# EAGLE design m5-3 (EAGLE 5.11)
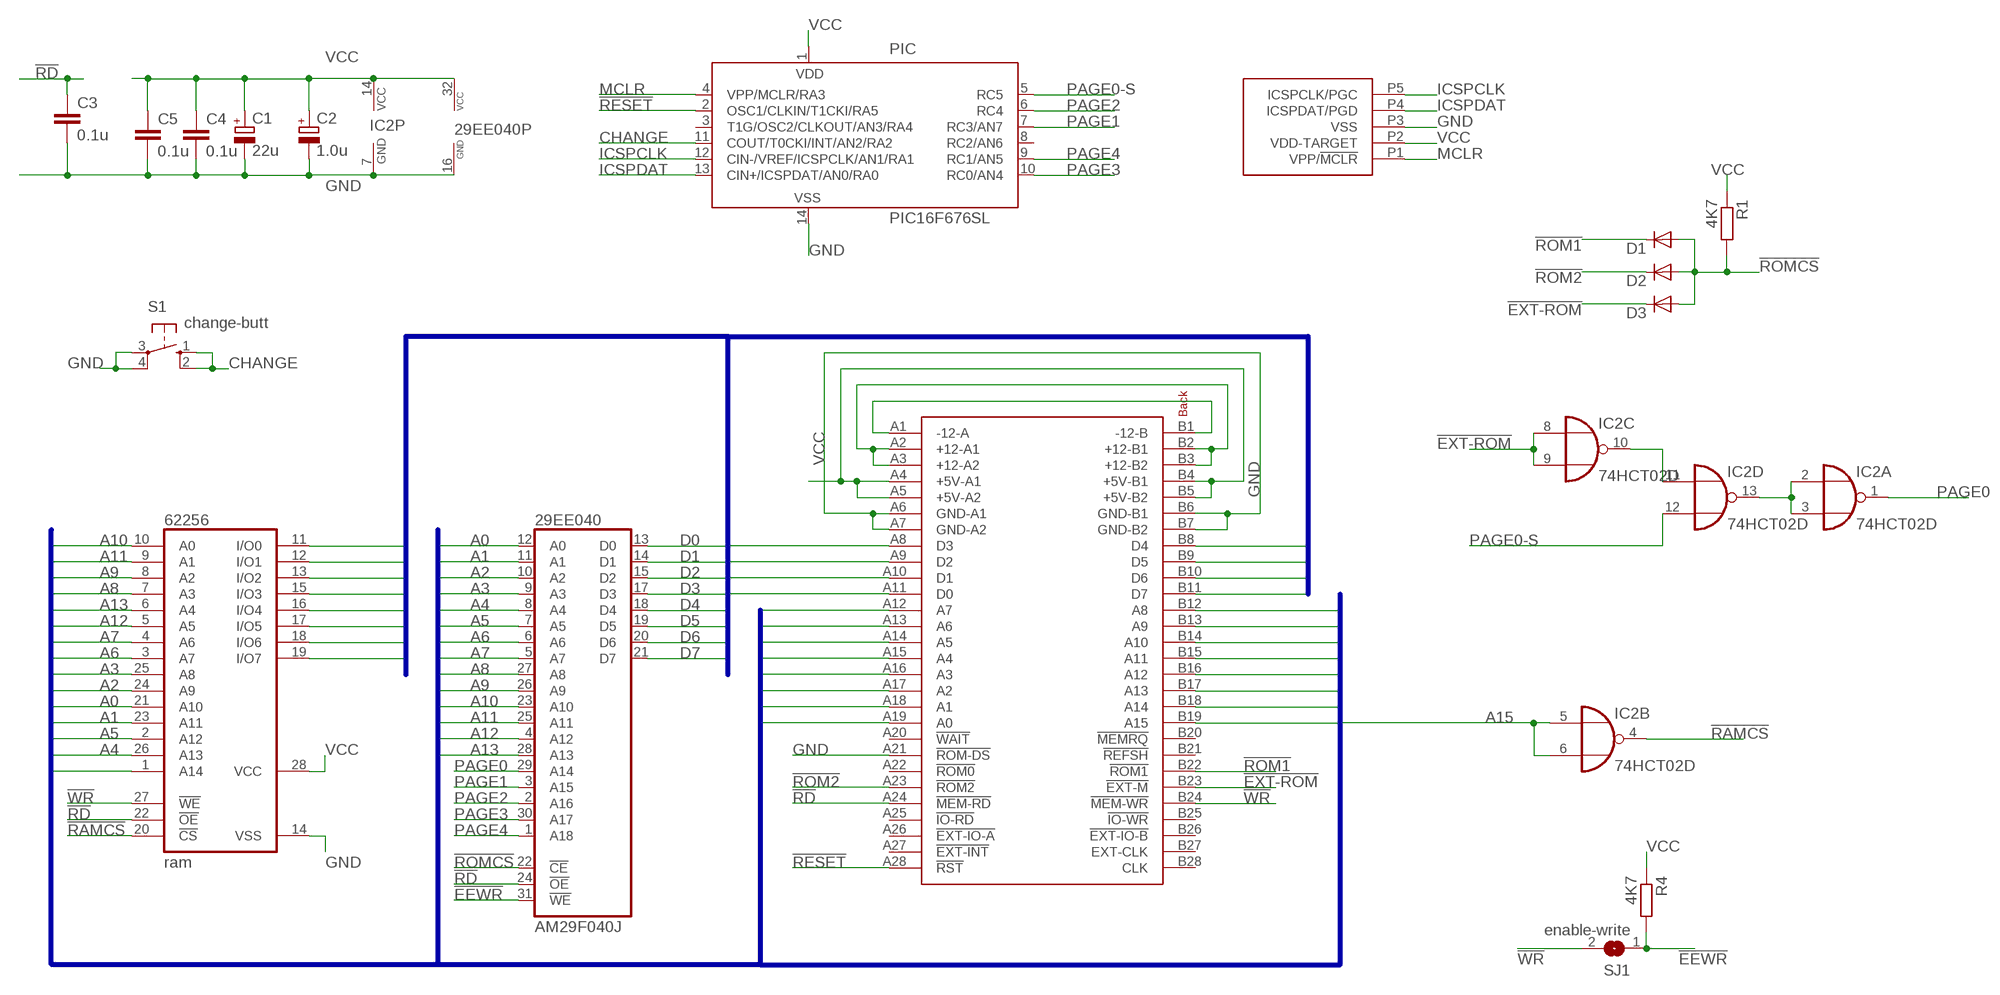
[diagram p0: schematic, sheet 1]

## Parts
29EE040  AM29F040J  [PLCC32R]
62256  ram  62256FP  [SO28L]
C1  22u  CPOL-EUC  [PANASONIC_C]
C2  1.0u  CPOL-EUC  [PANASONIC_C]
C3  0.1u  C-EUC1206  [C1206]
C4  0.1u  C-EUC1206  [C1206]
C5  0.1u  C-EUC1206  [C1206]
D1  DIODE-SOD123  [SOD123]
D2  DIODE-SOD123  [SOD123]
D3  DIODE-SOD123  [SOD123]
IC2  74HCT02D  [SO14]
PIC  PIC16F676SL  [SO-14]
R1  4K7  R-EU_R1206  [R1206]
R4  4K7  R-EU_R1206  [R1206]
S1  change-butt  40/XX  [B3F/40XX]
SJ1  enable-write  SJ  [SJ]
U$1  SORD-M5-EDGE  [SORD-M5-EDGE]
U$2  PICKIT2-ICSP-5  [PICKIT2-ICSP-5]

## Nets
!EEWR: 29EE040.31(!WE) R4.2 SJ1.1
!EXT-ROM: D3.C IC2.8(C:I0) IC2.9(C:I1) U$1.B23(!EXT-M)
!RAMCS: 62256.20(!CS) IC2.4(B:O)
!RD: 29EE040.24(!OE) 62256.22(!OE) C3.1 U$1.A24(!MEM-RD)
!RESET: PIC.2(OSC1/CLKIN/T1CKI/RA5) U$1.A28(!RST)
!ROM1: D1.C U$1.B22(!ROM1)
!ROM2: D2.C U$1.A23(!ROM2)
!ROMCS: 29EE040.22(!CE) D1.A D2.A D3.A R1.2
!WR: 62256.27(!WE) SJ1.2 U$1.B24(!MEM-WR)
A0: 29EE040.12(A0) 62256.21(A10) U$1.A19(A0)
A1: 29EE040.11(A1) 62256.23(A11) U$1.A18(A1)
A2: 29EE040.10(A2) 62256.24(A9) U$1.A17(A2)
A3: 29EE040.9(A3) 62256.25(A8) U$1.A16(A3)
A4: 29EE040.8(A4) 62256.26(A13) U$1.A15(A4)
A5: 29EE040.7(A5) 62256.2(A12) U$1.A14(A5)
A6: 29EE040.6(A6) 62256.3(A7) U$1.A13(A6)
A7: 29EE040.5(A7) 62256.4(A6) U$1.A12(A7)
A8: 29EE040.27(A8) 62256.7(A3) U$1.B12(A8)
A9: 29EE040.26(A9) 62256.8(A2) U$1.B13(A9)
A10: 29EE040.23(A10) 62256.10(A0) U$1.B14(A10)
A11: 29EE040.25(A11) 62256.9(A1) U$1.B15(A11)
A12: 29EE040.4(A12) 62256.5(A5) U$1.B16(A12)
A13: 29EE040.28(A13) 62256.6(A4) U$1.B17(A13)
A14: 62256.1(A14) U$1.B18(A14)
A15: IC2.5(B:I0) IC2.6(B:I1) U$1.B19(A15)
CHANGE: PIC.11(COUT/T0CKI/INT/AN2/RA2) S1.1(S) S1.2(S1)
D0: 29EE040.13(D0) 62256.19(I/O7) U$1.A11(D0)
D1: 29EE040.14(D1) 62256.18(I/O6) U$1.A10(D1)
D2: 29EE040.15(D2) 62256.17(I/O5) U$1.A9(D2)
D3: 29EE040.17(D3) 62256.16(I/O4) U$1.A8(D3)
D4: 29EE040.18(D4) 62256.15(I/O3) U$1.B8(D4)
D5: 29EE040.19(D5) 62256.11(I/O0) U$1.B9(D5)
D6: 29EE040.20(D6) 62256.12(I/O1) U$1.B10(D6)
D7: 29EE040.21(D7) 62256.13(I/O2) U$1.B11(D7)
GND: 29EE040.16(GND) 62256.14(VSS) C1.- C2.- C3.2 C4.2 C5.2 IC2.7(P:GND) PIC.14(VSS) S1.3(P) S1.4(P1) U$1.A6(GND-A1) U$1.A7(GND-A2) U$1.A21(!ROM-DS) U$1.B6(GND-B1) U$1.B7(GND-B2) U$2.P3(VSS)
ICSPCLK: PIC.12(CIN-/VREF/ICSPCLK/AN1/RA1) U$2.P5(ICSPCLK/PGC)
ICSPDAT: PIC.13(CIN+/ICSPDAT/AN0/RA0) U$2.P4(ICSPDAT/PGD)
MCLR: PIC.4(VPP/MCLR/RA3) U$2.P1(VPP/!MCLR)
N$2: U$1.A1(-12-A) U$1.B1(-12-B)
N$3: IC2.10(C:O) IC2.11(D:I0)
N$5: U$1.A2(+12-A1) U$1.A3(+12-A2) U$1.B2(+12-B1) U$1.B3(+12-B2)
N$6: IC2.2(A:I0) IC2.3(A:I1) IC2.13(D:O)
PAGE0: 29EE040.29(A14) IC2.1(A:O)
PAGE0-S: IC2.12(D:I1) PIC.5(RC5)
PAGE1: 29EE040.3(A15) PIC.7(RC3/AN7)
PAGE2: 29EE040.2(A16) PIC.6(RC4)
PAGE3: 29EE040.30(A17) PIC.10(RC0/AN4)
PAGE4: 29EE040.1(A18) PIC.9(RC1/AN5)
VCC: 29EE040.32(VCC) 62256.28(VCC) C1.+ C2.+ C4.1 C5.1 IC2.14(P:VCC) PIC.1(VDD) R1.1 R4.1 U$1.A4(+5V-A1) U$1.A5(+5V-A2) U$1.B4(+5V-B1) U$1.B5(+5V-B2) U$2.P2(VDD-TARGET)
Unconnected: PIC.3(T1G/OSC2/CLKOUT/AN3/RA4) PIC.8(RC2/AN6) U$1.A20(!WAIT) U$1.A22(!ROM0) U$1.A25(!IO-RD) U$1.A26(!EXT-IO-A) U$1.A27(!EXT-INT) U$1.B20(!MEMRQ) U$1.B21(!REFSH) U$1.B25(!IO-WR) U$1.B26(!EXT-IO-B) U$1.B27(EXT-CLK) U$1.B28(CLK)

## Buses
D[0..7]
A[0..15]

## Library data of the parts
29EE040 = am29-memory:AM29F040J: 4-Megabit FLASH MEMORY (512 K x 8 bit) 5 V-only
62256 = memory-hitachi:62256FP: MEMORY
C1 C2 = resistor:CPOL-EU: POLARIZED CAPACITOR, European symbol
C3-C5 = resistor:C-EU: CAPACITOR, European symbol
D1-D3 = diode:DIODE-: DIODE
IC2 = 74xx-eu:74*02: Quad 2-input NOR gate
PIC = microchip:PIC16F676: 14-Pin, Flash-Based 8-Bit CMOS Microcontroller High Performance RISC CPU: * Only 35 instructions to learn - All single-cycle instructions except branches * Operating speed: - DC - 20 MHz oscillator/clock input - DC - 200 ns instruction cycle * Internal and external oscillator options - Precision Internal 4 MHz oscillator factory calibrated to ±1% - External Oscillator support for crystals and resonators - 5?s wake-up from SLEEP, 3.0V, typical * Power saving SLEEP mode * Wide operating voltage range - 2.0V to 5.5V * Industrial and Extended temperature range * Low power Power-on Reset (POR) * Power-up Timer (PWRT) and Oscillator Start-up Timer (OST) * Brown-out Detect (BOD) * Watchdog Timer (WDT) with independent oscillator for reliable operation * Multiplexed MCLR/Input-pin * Interrupt-on-pin change * Individual programmable weak pull-ups * Programmable code protection * High Endurance FLASH/EEPROM Cell - 100,000 write FLASH endurance - 1,000,000 write EEPROM endurance - FLASH/Data EEPROM Retention: > 40 years * Standby Current: - 1 nA @ 2.0V, typical * Operating Current: - 8.5?A @ 32 kHz, 2.0V, typical - 100?A @ 1 MHz, 2.0V, typical * Watchdog Timer Current - 300 nA @ 2.0V, typical * Timer1 oscillator current: - 4?A @ 32 kHz, 2.0V, typical * 12 I/O pins with individual direction control * High current sink/source for direct LED drive * Analog-to-Digital Converter module (PIC16F676): - 10-bit resolution - Programmable 8-channel input - Voltage reference input * In-Circuit Serial ProgrammingTM (ICSPTM) via two pins Source: http://ww1.microchip.com/downloads/en/DeviceDoc/40039E.pdf
R1 R4 = rcl:R-EU_: RESISTOR, European symbol
S1 = switch-omron:40/XX: OMRON SWITCH
SJ1 = jumper:SJ: SMD solder JUMPER
U$1 = SordM5:SORD-M5-EDGE: Sord M5 Cartridge Connector
U$2 = pickit2:PICKIT2-ICSP-5: PICKit2 ICSP header - 5 pin version

## Board
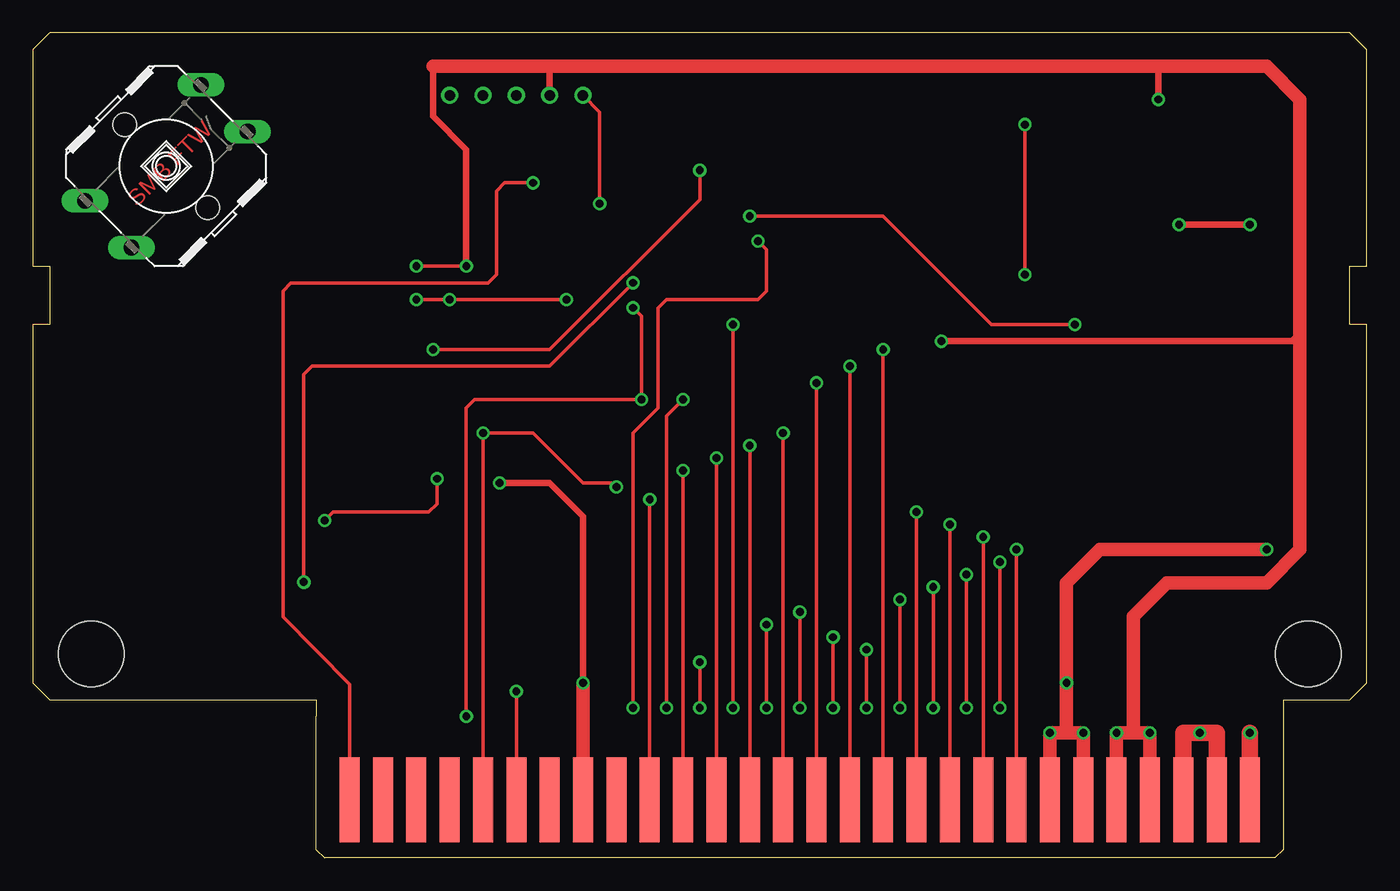
[diagram p1: board, top side]
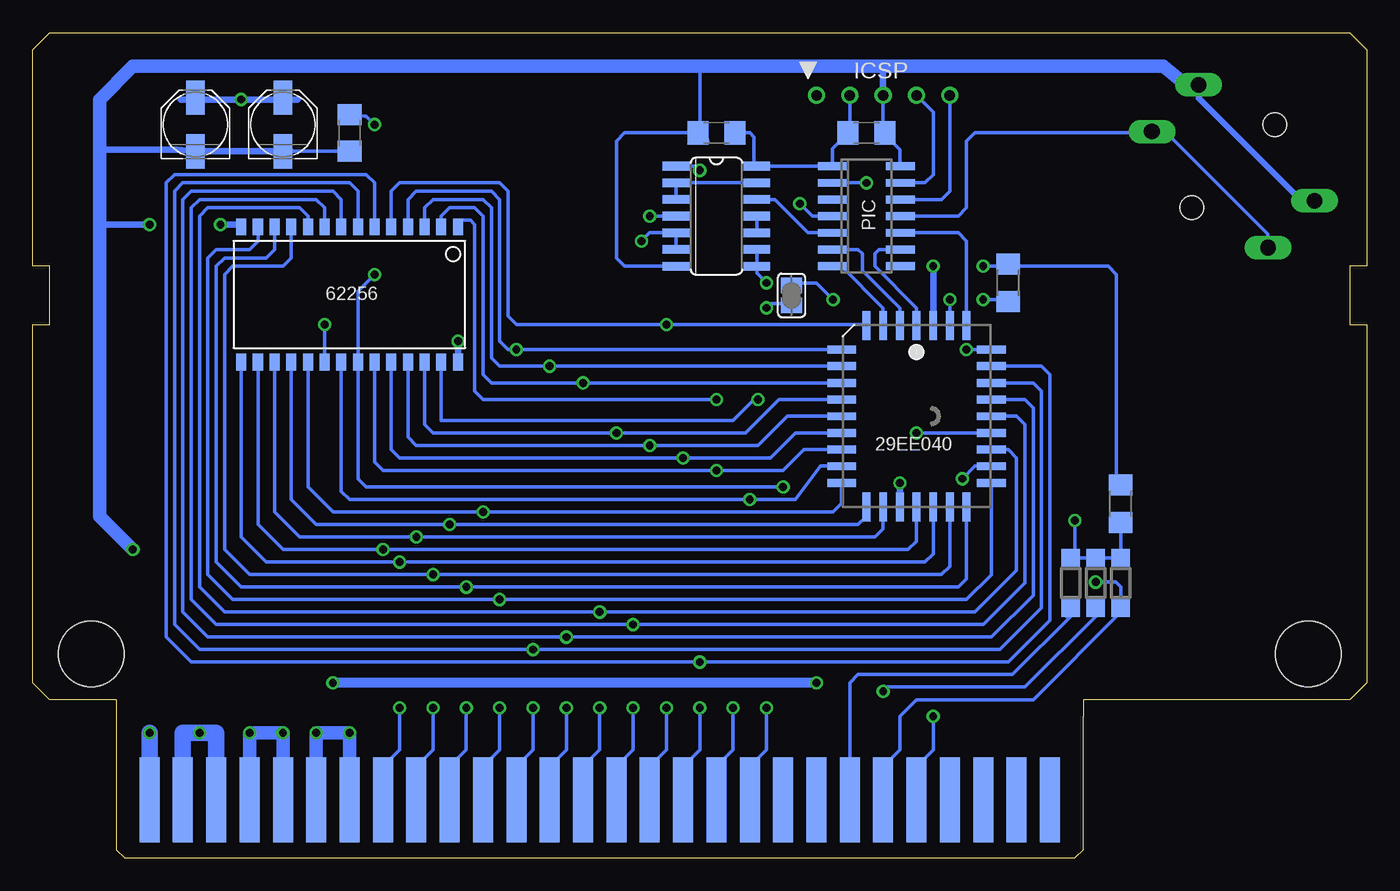
[diagram p2: board, bottom side, seen from below]

Size 101.6 x 62.87 mm. Coordinates in mm from the lower left corner, seen from the top.
Outline: 21.59,10.8 21.59,12.07 1.27,12.07 0,13.34 0,40.64 1.27,40.64 1.27,45.09 0,45.09 0,61.59 1.27,62.87 100.33,62.87 101.6,61.59 101.6,45.09 100.33,45.09 100.33,40.64 101.6,40.64 101.6,13.34 100.33,12.07 95.25,12.07 95.25,10.8
Copper layers (1*16): Top 0.035mm / dielectric 1.5mm / Bottom 0.035mm
Design rules "default": minimum track width 10mil, minimum drill 24mil, track to track 8mil, track to pad 8mil, pad to pad 8mil, via to via 8mil, smd to smd 8mil, copper to edge 40mil, drill to drill 8mil, minimum pad ring 10mil, minimum via ring 8mil, stop-mask expansion 4mil, vias tented up to drill 0mil, thermal gap 10mil
Holes 5 mm at 97.16,15.56 4.45,15.56

### Footprints (pad centres in the part's own frame; a part is rotated, then mirrored left to right if it is on the bottom)
PLCC32R = smd 0.6 x 2.2: 1 0,6.9; 2 -1.27,6.9; 3 -2.54,6.9; 4 -3.81,6.9; 14 -3.81,-6.9; 15 -2.54,-6.9; 16 -1.27,-6.9; 17 0,-6.9; 18 1.27,-6.9; 19 2.54,-6.9; 20 3.81,-6.9; 30 3.81,6.9; 31 2.54,6.9; 32 1.27,6.9 | smd 2.2 x 0.6: 5 -5.7,5.08; 6 -5.7,3.81; 7 -5.7,2.54; 8 -5.7,1.27; 9 -5.7,0; 10 -5.7,-1.27; 11 -5.7,-2.54; 12 -5.7,-3.81; 13 -5.7,-5.08; 21 5.7,-5.08; 22 5.7,-3.81; 23 5.7,-2.54; 24 5.7,-1.27; 25 5.7,0; 26 5.7,1.27; 27 5.7,2.54; 28 5.7,3.81; 29 5.7,5.08
SO28L = smd 0.762 x 1.27: 1 -7.62,-5.207; 2 -6.35,-5.207; 3 -5.08,-5.207; 4 -3.81,-5.207; 5 -2.54,-5.207; 6 -1.27,-5.207; 7 0,-5.207; 8 1.27,-5.207; 9 2.54,-5.207; 10 3.81,-5.207; 11 5.08,-5.207; 12 6.35,-5.207; 13 7.62,-5.207; 14 8.89,-5.207; 15 8.89,5.08; 16 7.62,5.08; 17 6.35,5.08; 18 5.08,5.08; 19 3.81,5.08; 20 2.54,5.08; 21 1.27,5.08; 22 0,5.08; 23 -1.27,5.08; 24 -2.54,5.08; 25 -3.81,5.08; 26 -5.08,5.08; 27 -6.35,5.08; 28 -7.62,5.08
PANASONIC_C = smd 2.6 x 1.4: + 2.05,0; - -2.05,0
C1206 = smd 1.6 x 1.8: 1 -1.4,0; 2 1.4,0
SOD123 = smd 1.4 x 1.4: A 1.9,0; C -1.9,0
SO14 = smd 0.66 x 2.032: 1 -3.81,-3.073; 2 -2.54,-3.073; 3 -1.27,-3.073; 4 0,-3.073; 5 1.27,-3.073; 6 2.54,-3.073; 7 3.81,-3.073; 8 3.81,3.073; 9 2.54,3.073; 10 1.27,3.073; 11 0,3.073; 12 -1.27,3.073; 13 -2.54,3.073; 14 -3.81,3.073
SO-14 = smd 0.6 x 2.2: 1 -3.81,-2.6; 2 -2.54,-2.6; 3 -1.27,-2.6; 4 0,-2.6; 5 1.27,-2.6; 6 2.54,-2.6; 7 3.81,-2.6; 8 3.81,2.6; 9 2.54,2.6; 10 1.27,2.6; 11 0,2.6; 12 -1.27,2.6; 13 -2.54,2.6; 14 -3.81,2.6
R1206 = smd 1.6 x 1.803: 1 -1.422,0; 2 1.422,0
B3F/40XX = drill 1.194 long: 1 -6.198,-2.642; 2 2.642,6.198; 3 -2.642,-6.198; 4 6.198,2.642 | hole 1.803: -3.175,3.175; 3.175,-3.175
SJ = smd 1.168 x 1.6: 1 -0.762,0; 2 0.762,0
SORD-M5-EDGE = smd 1.524 x 6.477: A1 34.29,0; A2 31.75,0; A3 29.21,0; A4 26.67,0; A5 24.13,0; A6 21.59,0; A7 19.05,0; A8 16.51,0; A9 13.97,0; A10 11.43,0; A11 8.89,0; A12 6.35,0; A13 3.81,0; A14 1.27,0; A15 -1.27,0; A16 -3.81,0; A17 -6.35,0; A18 -8.89,0; A19 -11.43,0; A20 -13.97,0; A21 -16.51,0; A22 -19.05,0; A23 -21.59,0; A24 -24.13,0; A25 -26.67,0; A26 -29.21,0; A27 -31.75,0; A28 -34.29,0 | smd 1.524 x 6.477 bottom: B1 34.29,0; B2 31.75,0; B3 29.21,0; B4 26.67,0; B5 24.13,0; B6 21.59,0; B7 19.05,0; B8 16.51,0; B9 13.97,0; B10 11.43,0; B11 8.89,0; B12 6.35,0; B13 3.81,0; B14 1.27,0; B15 -1.27,0; B16 -3.81,0; B17 -6.35,0; B18 -8.89,0; B19 -11.43,0; B20 -13.97,0; B21 -16.51,0; B22 -19.05,0; B23 -21.59,0; B24 -24.13,0; B25 -26.67,0; B26 -29.21,0; B27 -31.75,0; B28 -34.29,0
PICKIT2-ICSP-5 = drill 0.8 round: P1 0,5.08; P2 0,2.54; P3 0,0; P4 0,-2.54; P5 0,-5.08

### Placement (x,y rotation side)
29EE040  34.29,33.66 0 bottom
62256  76.83,42.86 180 bottom
C1  82.55,55.88 90 bottom
C2  89.22,55.88 90 bottom
C3  77.47,55.25 270 bottom
C4  38.1,55.25 0 bottom
C5  49.53,55.25 180 bottom
D1  22.54,20.96 90 bottom
D2  20.64,20.96 90 bottom
D3  18.73,20.96 90 bottom
IC2  49.53,48.9 270 bottom
PIC  38.1,48.9 270 bottom
R1  18.73,26.99 270 bottom
R4  27.3,43.81 270 bottom
S1  10.16,52.7 180 top
SJ1  43.81,42.86 270 bottom
U$1  58.42,4.45 0 top
U$2  36.83,58.1 90 bottom

### Tracks (layer width: path | path; a pad name or v marks a point on that pad's centre or on a via)
!EEWR  (via drill 0.6)
  Top 0.254: v40.64,42.55 v31.75,42.55 v29.21,42.55
  Bottom 0.254: SJ1.1 43.62,43.81 41.91,43.81 v40.64,42.55 | v31.75,42.55 29EE040.31 | v29.21,42.55 27.94,42.55 27.79,42.39 R4.2
!EXT-ROM  (via drill 0.6, 0.61)
  Top 0.254: v45.72,43.81 39.37,37.47 21.27,37.47 20.64,36.83 v20.64,21.02
  Bottom 0.254: U$1.B23 36.83,6.98 35.56,8.26 35.56,10.8 34.29,12.07 25.41,12.07 18.73,18.73 D3.C | IC2.9 IC2.8 46.46,44.55 v45.72,43.81 | v20.64,21.02 19.11,21.02 18.73,20.64 D3.C | D3.C 18.8,19.18
!RAMCS  (via drill 0.6)
  Top 0.254: v79.38,40.64 73.03,40.64 64.77,48.9 v54.61,48.9
  Bottom 0.254: v79.38,40.64 62256.20 | IC2.4 v54.61,48.9
!RD  (via drill 0.6)
  Top 0.254: U$1.A24 v34.29,32.39 38.1,32.39 41.91,28.58 44.13,28.58 v44.45,28.26 | v75.56,44.45 v75.56,55.88
  Bottom 0.254: v75.56,44.45 76.83,43.18 62256.22 76.83,28.89 76.2,28.26 v44.45,28.26 | 29EE040.24 v34.29,32.39 | 76.33,56.52 C3.1 76.2,56.52 v75.56,55.88
!RESET  (via drill 0.6)
  Top 0.254: v38.1,51.44 35.94,51.44 35.31,50.8 35.31,44.45 34.67,43.81 19.62,43.81 19.05,43.18 19.05,18.35 24.13,13.21 U$1.A28
  Bottom 0.254: v38.1,51.44 PIC.2
!ROM1
  Bottom 0.254: U$1.B22 39.37,13.34 38.73,13.97 26.99,13.97 22.54,18.41 22.86,18.41 D1.C
!ROM2  (via drill 0.6)
  Top 0.254: v36.83,12.7 U$1.A23
  Bottom 0.254: v36.83,12.7 36.51,13.02 26.04,13.02 20.64,18.41 D2.C
!ROMCS  (via drill 0.6)
  Top 0.254: v30.8,28.89 30.8,26.99 30.16,26.35 22.86,26.35 v22.23,25.72
  Bottom 0.254: 29EE040.22 29.84,29.84 v30.8,28.89 | v22.23,25.72 22.23,23.18 D1.A D2.A D3.A R1.2
!WR  (via drill 0.6)
  Top 0.254: v33.02,10.8 33.02,34.29 33.66,34.92 v46.35,34.92 46.35,41.28 v45.72,41.91
  Bottom 0.254: U$1.B24 34.29,6.98 33.02,8.26 v33.02,10.8 | 62256.27 70.48,33.34 48.26,33.34 46.67,34.92 v46.35,34.92 | v45.72,41.91 45.4,42.23 44.13,42.23 SJ1.2
A0  (via drill 0.6)
  Top 0.254: v46.99,27.3 U$1.A19
  Bottom 0.254: 29EE040.12 41.59,29.84 43.5,27.3 v46.99,27.3 77.47,27.3 78.11,27.94 62256.21
A1  (via drill 0.6)
  Top 0.254: v49.53,29.53 U$1.A18
  Bottom 0.254: 29EE040.11 42.86,31.12 44.45,29.53 v49.53,29.53 74.93,29.53 75.56,30.16 62256.23
A2  (via drill 0.6)
  Top 0.254: v52.07,30.48 U$1.A17
  Bottom 0.254: 29EE040.10 43.5,32.39 45.4,30.48 v52.07,30.48 73.66,30.48 74.3,31.12 62256.24
A3  (via drill 0.6)
  Top 0.254: U$1.A16 v54.61,31.43
  Bottom 0.254: 29EE040.9 44.13,33.66 46.35,31.43 v54.61,31.43 72.39,31.43 73.03,32.07 62256.25
A4  (via drill 0.6)
  Top 0.254: U$1.A15 v57.15,32.39
  Bottom 0.254: 29EE040.8 44.77,34.92 47.31,32.39 v57.15,32.39 71.12,32.39 71.75,33.02 62256.26
A5  (via drill 0.6)
  Top 0.254: U$1.A14 v59.69,36.2
  Bottom 0.254: 29EE040.7 v59.69,36.2 66.67,36.2 67.31,36.83 67.31,48.9 67.94,49.53 69.85,49.53 70.48,48.9 62256.2
A6  (via drill 0.6)
  Top 0.254: U$1.A13 v62.23,37.47
  Bottom 0.254: 29EE040.6 v62.23,37.47 66.04,37.47 66.67,38.1 66.67,49.53 67.31,50.17 71.12,50.17 71.75,49.53 62256.3
A7  (via drill 0.6)
  Top 0.254: U$1.A12 v64.77,38.73
  Bottom 0.254: 29EE040.5 v64.77,38.73 65.41,38.73 66.04,39.37 66.04,50.17 66.67,50.8 72.39,50.8 73.03,50.17 62256.4
A8  (via drill 0.6)
  Top 0.254: v63.5,15.88 v63.5,11.43
  Bottom 0.254: 62256.7 76.83,50.8 77.47,51.44 90.17,51.44 90.81,50.8 90.81,17.78 88.9,15.88 v63.5,15.88 27.94,15.88 24.77,19.05 24.77,35.56 25.4,36.2 29EE040.27 | v63.5,11.43 63.5,8.26 64.77,6.98 U$1.B12
A9  (via drill 0.6)
  Top 0.254: v60.96,16.83 v60.96,11.43
  Bottom 0.254: 29EE040.26 26.04,34.92 25.4,34.29 25.4,20 28.57,16.83 v60.96,16.83 88.27,16.83 90.17,18.73 90.17,50.17 89.53,50.8 78.74,50.8 78.11,50.17 62256.8 | v60.96,11.43 60.96,8.26 62.23,6.98 U$1.B13
A10  (via drill 0.6)
  Top 0.254: v58.42,11.43 v58.42,18.73
  Bottom 0.254: 29EE040.23 27.3,31.12 26.67,30.48 26.67,21.91 29.84,18.73 v58.42,18.73 87,18.73 88.9,20.64 88.9,48.9 88.27,49.53 81.28,49.53 80.64,48.9 62256.10 | v58.42,11.43 58.42,8.26 59.69,6.98 U$1.B14
A11  (via drill 0.6)
  Top 0.254: v55.88,17.78 v55.88,11.43
  Bottom 0.254: 29EE040.25 26.67,33.66 26.04,33.02 26.04,20.96 29.21,17.78 v55.88,17.78 87.63,17.78 89.53,19.69 89.53,49.53 88.9,50.17 80.01,50.17 79.38,49.53 62256.9 | v55.88,11.43 55.88,8.26 57.15,6.98 U$1.B15
A12  (via drill 0.6)
  Top 0.254: v53.34,11.43 v53.34,40.64
  Bottom 0.254: 38.19,40.87 29EE040.4 38.19,40.64 v53.34,40.64 64.77,40.64 65.41,41.28 65.41,50.8 66.04,51.44 73.66,51.44 74.3,50.8 62256.5 | v53.34,11.43 53.34,8.26 54.61,6.98 U$1.B16
A13  (via drill 0.6)
  Top 0.254: v50.8,11.43 v50.8,14.92
  Bottom 0.254: 29EE040.28 24.77,37.47 24.13,36.83 24.13,18.1 27.3,14.92 v50.8,14.92 89.53,14.92 91.44,16.83 91.44,51.44 90.81,52.07 76.2,52.07 75.56,51.44 62256.6 | v50.8,11.43 50.8,8.26 52.07,6.98 U$1.B17
A14  (via drill 0.6)
  Top 0.254: v48.26,11.43 48.26,33.66 v49.53,34.92
  Bottom 0.254: v49.53,34.92 67.31,34.92 67.94,35.56 67.94,48.26 68.26,48.58 69.03,48.58 62256.1 | v48.26,11.43 48.26,8.26 49.53,6.98 U$1.B18
A15  (via drill 0.6)
  Top 0.254: v45.72,11.43 45.72,32.39 47.62,34.29 47.62,41.91 48.26,42.55 55.24,42.55 55.88,43.18 55.88,46.36 v55.24,46.99
  Bottom 0.254: U$1.B19 46.99,6.98 45.72,8.26 v45.72,11.43 | IC2.6 IC2.5 54.61,47.62 v55.24,46.99
CHANGE
  Bottom 0.254: S1.2 7.52,47.52 15.34,55.35 S1.1 16.46,55.25 29.84,55.25 30.48,54.61 30.48,49.53 31.11,48.9 PIC.11
D0  (via drill 0.6)
  Top 0.254: v67.31,26.35 U$1.A11
  Bottom 0.254: 29EE040.13 39.99,27 40.64,26.35 v67.31,26.35 78.74,26.35 80.64,28.26 62256.19
D1  (via drill 0.6)
  Top 0.254: v69.85,25.4 U$1.A10
  Bottom 0.254: 29EE040.14 38.1,26.04 38.73,25.4 v69.85,25.4 80.01,25.4 81.92,27.3 62256.18
D2  (via drill 0.6)
  Top 0.254: v72.39,24.45 U$1.A9
  Bottom 0.254: 29EE040.15 36.83,25.08 37.47,24.45 v72.39,24.45 81.28,24.45 83.19,26.35 62256.17
D3  (via drill 0.6)
  Top 0.254: v74.93,23.5 U$1.A8
  Bottom 0.254: 29EE040.17 34.29,24.13 34.92,23.5 v74.93,23.5 82.55,23.5 84.45,25.4 62256.16
D4  (via drill 0.6)
  Top 0.254: v73.66,22.54 v73.66,11.43
  Bottom 0.254: 29EE040.18 33.02,23.18 33.66,22.54 v73.66,22.54 83.82,22.54 85.72,24.45 62256.15 | v73.66,11.43 73.66,8.26 74.93,6.98 U$1.B8
D5  (via drill 0.6)
  Top 0.254: v71.12,21.59 v71.12,11.43
  Bottom 0.254: 29EE040.19 31.75,22.23 32.38,21.59 v71.12,21.59 85.09,21.59 87,23.5 87,44.45 86.36,45.09 82.55,45.09 81.92,45.72 62256.11 | v71.12,11.43 71.12,8.26 72.39,6.98 U$1.B9
D6  (via drill 0.6)
  Top 0.254: v68.58,20.64 v68.58,11.43
  Bottom 0.254: 29EE040.20 30.48,21.27 31.11,20.64 v68.58,20.64 85.72,20.64 87.63,22.54 87.63,45.09 87,45.72 83.82,45.72 83.19,46.36 62256.12 | v68.58,11.43 68.58,8.26 69.85,6.98 U$1.B10
D7  (via drill 0.6)
  Top 0.254: v66.04,19.69 v66.04,11.43
  Bottom 0.254: 29EE040.21 28.59,21.58 30.48,19.69 v66.04,19.69 86.36,19.69 88.27,21.59 88.27,45.72 87.63,46.36 85.09,46.36 84.45,46.99 62256.13 | v66.04,11.43 66.04,8.26 67.31,6.98 U$1.B11
GND  (via drill 0.6)
  Top 0.508: v92.71,48.26 v87.31,48.26 | v35.56,28.58 39.37,28.58 41.91,26.04 v41.91,13.34
  Top 1.016: U$1.A6 v80.01,9.52 v77.47,9.52 | v77.47,9.52 U$1.A7 | v41.91,13.34 U$1.A21 | v93.98,23.5 81.28,23.5 78.74,20.96 v78.74,13.34 78.74,9.52 v77.47,9.52
  Bottom 0.254: PIC.14 35.56,52.77 35.56,53.98 36.7,55.12 C4.2 36.83,55.38 U$2.P3 | C3.2 81.9,53.84 81.92,53.83 | 50.16,54.48 C5.2 | 50.16,54.48 50.16,54.61 50.8,55.25 50.8,60.33 | 50.16,54.48 arc-90 C5.2 | C5.2 56.52,55.25 57.15,54.61 57.15,45.72 56.52,45.09 IC2.7 | S1.3 12.95,59.05
  Bottom 0.508: 81.92,53.83 C1.- C2.- 90.63,53.98 96.52,53.98 | S1.3 12.8,57.89 4.98,50.06 S1.4 | v87.31,48.26 85.72,48.26 62256.14 | 96.52,48.26 v92.71,48.26 | 36.83,60.33 U$2.P3 | 29EE040.16 v35.56,28.58
  Bottom 0.762: v41.91,13.34 v78.74,13.34
  Bottom 1.016: U$1.A7 v77.47,9.52 v80.01,9.52 U$1.A6 | S1.3 13.97,59.05 15.49,60.33 36.83,60.33 50.8,60.33 93.98,60.33 96.52,57.79 96.52,53.98 96.52,48.26 96.52,26.04 v93.98,23.5
ICSPCLK
  Bottom 0.254: U$2.P5 31.75,50.8 32.38,50.17 PIC.12
ICSPDAT
  Bottom 0.254: U$2.P4 33.02,56.83 33.02,52.07 33.66,51.44 PIC.13
MCLR  (via drill 0.6)
  Top 0.254: v43.18,49.85 43.18,56.83 U$2.P1
  Bottom 0.254: PIC.4 42.23,48.9 v43.18,49.85
N$2  (via drill 0.6)
  Top 1.27: v92.71,9.52 U$1.B1
  Bottom 1.27: U$1.B1 v92.71,9.52
N$3
  Bottom 0.254: IC2.10 IC2.11
N$5  (via drill 0.6)
  Top 1.27: U$1.B3 87.63,9.52 v88.9,9.52 90.17,9.52 U$1.B2
  Bottom 1.27: U$1.B3 87.63,9.52 v88.9,9.52 90.17,9.52 U$1.B2
N$6
  Bottom 0.254: IC2.3 IC2.2 IC2.13
PAGE0  (via drill 0.6)
  Top 0.254: v50.8,52.39 50.8,50.17 39.37,38.73 v30.48,38.73
  Bottom 0.254: IC2.1 51.12,52.7 v50.8,52.39 | 29EE040.29 v30.48,38.73
PAGE0-S
  Bottom 0.254: PIC.5 42.55,47.62 45.09,50.17 IC2.12
PAGE1
  Bottom 0.254: 29EE040.3 36.83,41.91 40.01,45.09 PIC.7
PAGE2
  Bottom 0.254: 29EE040.2 35.56,41.91 38.42,44.77 38.42,46.04 38.73,46.36 PIC.6
PAGE3
  Bottom 0.254: 29EE040.30 30.48,46.99 31.11,47.62 PIC.10
PAGE4
  Bottom 0.254: 29EE040.1 34.29,41.91 37.47,45.09 37.47,46.04 37.15,46.36 PIC.9
VCC  (via drill 0.6)
  Top 0.254: 84.77,60.33 84.45,60.01 | 91.44,60.33 86.04,60.33 85.72,60.01 | v29.21,45.09 v33.02,45.09
  Top 0.508: 85.72,60.01 v85.72,57.79 | v33.02,45.09 33.02,53.98 30.48,56.52 30.48,60.33 | 39.37,60.33 U$2.P2 | v69.22,39.37 95.89,39.37 96.52,40.01
  Top 1.016: U$1.B5 v82.55,9.52 83.82,9.52 | 83.82,9.52 v85.09,9.52 U$1.B4 | 30.48,60.33 39.37,60.33 84.77,60.33 91.44,60.33 93.98,60.33 96.52,57.79 96.52,40.01 96.52,23.5 93.98,20.96 86.36,20.96 83.82,18.41 83.82,9.52
  Bottom 0.254: 81.42,57.79 C1.+ | 90.34,57.79 C2.+ | C5.1 46.99,55.25 46.67,54.93 46.67,52.92 IC2.14 PIC.1 40.7,54.05 C4.1 39.5,55.38 39.37,55.25 U$2.P2 | 27.15,45.09 v29.21,45.09 | 27.15,45.09 R4.1 | 27.15,45.09 19.68,45.09 19.05,44.45 19.05,28.58 18.88,28.41 R1.1
  Bottom 0.508: 81.42,57.79 v85.72,57.79 90.34,57.79 | v33.02,45.09 29EE040.32 | v69.22,39.37 62256.28
  Bottom 1.016: U$1.B5 v82.55,9.52 v85.09,9.52 U$1.B4

### Text on the board
Top: SMB FTW
tValues: M5-Multi | The Centre For Computing History | www.computinghistory.org.uk
bValues: Designed by | !EEWR | Charlie Robson | Huge thanks to | Simon Hardy